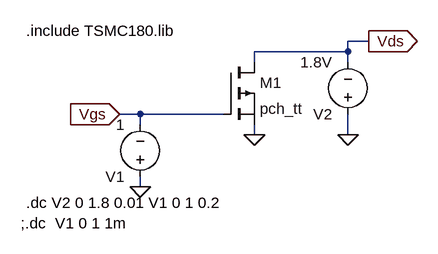
[diagram p0: schematic Prob_4a2.asc]
Prob_4a2.asc, the LTspice schematic file:
Version 4
SHEET 1 880 680
WIRE 400 48 368 48
WIRE 368 64 368 48
WIRE 368 64 224 64
WIRE 224 80 224 64
WIRE 368 80 368 64
WIRE 48 160 16 160
WIRE 176 160 48 160
WIRE 48 176 48 160
WIRE 224 192 224 176
WIRE 368 192 368 160
WIRE 48 272 48 256
FLAG 48 272 0
FLAG 224 192 0
FLAG 368 192 0
FLAG 16 160 Vgs
IOPIN 16 160 In
FLAG 400 48 Vds
IOPIN 400 48 Out
SYMBOL voltage 48 272 R180
WINDOW 123 0 0 Left 0
WINDOW 39 0 0 Left 0
SYMATTR InstName V1
SYMATTR Value 1
SYMBOL voltage 368 176 R180
WINDOW 123 0 0 Left 0
WINDOW 39 0 0 Left 0
SYMATTR InstName V2
SYMATTR Value 1.8V
SYMBOL pmos 176 80 R0
SYMATTR InstName M1
SYMATTR Value pch_tt
TEXT -128 32 Left 2 !.include TSMC180.lib
TEXT -128 296 Left 2 !.dc V2 0 1.8 0.01 V1 0 1 0.2
TEXT -136 328 Left 2 !;.dc  V1 0 1 1m

The netlist it stands for:
* Prob_4a2.asc
V1 0 Vgs 1
V2 0 Vds 1.8V
M1 Vds Vgs 0 0 pch_tt
.model NMOS NMOS
.model PMOS PMOS
.lib standard.mos
.include TSMC180.lib
.dc V2 0 1.8 0.01 V1 0 1 0.2
;.dc  V1 0 1 1m
.backanno
.end